# Altium schematic sheet Top.SchDoc
size A4; SheetNumber: 1; SheetTotal: 5
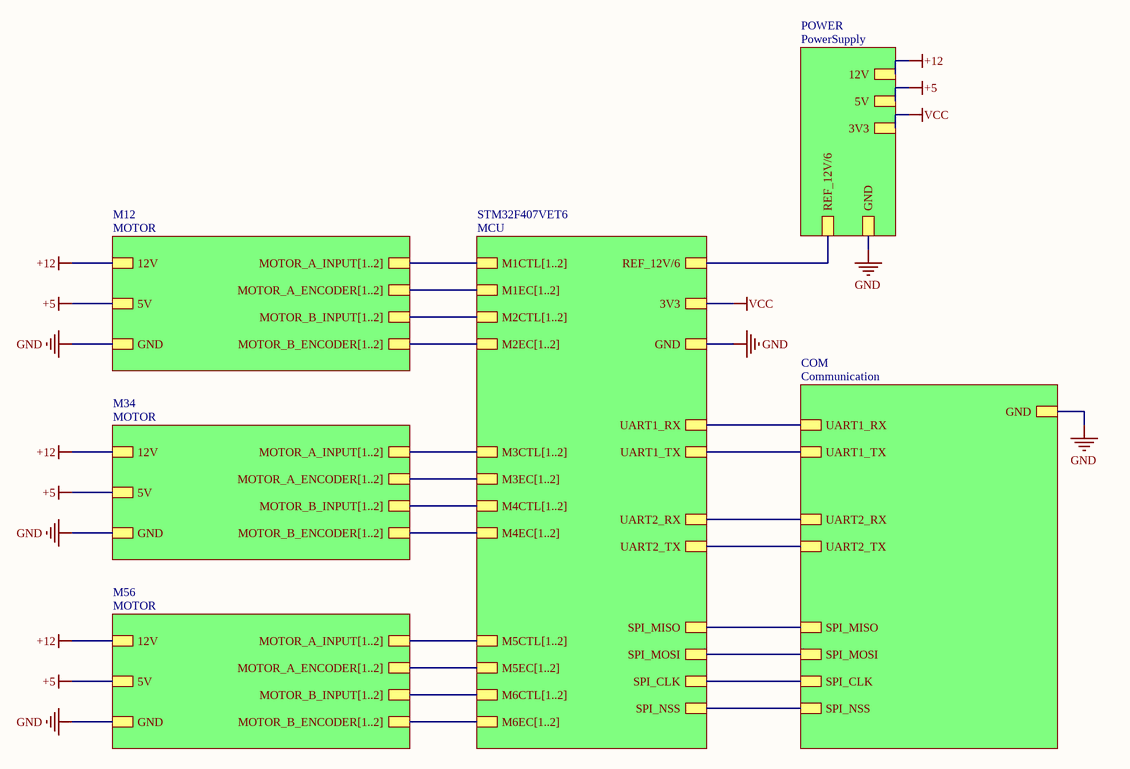
[diagram p0: Top.SchDoc]

## Sub-sheets
COM = Communication: UART1_RX, UART1_TX, UART2_RX, UART2_TX, SPI_MISO, SPI_MOSI, SPI_CLK, SPI_NSS, GND
M12 = MOTOR: 12V, GND, MOTOR_A_INPUT[1..2], MOTOR_A_ENCODER[1..2], 5V, MOTOR_B_ENCODER[1..2], MOTOR_B_INPUT[1..2]
M34 = MOTOR: 12V, GND, MOTOR_A_INPUT[1..2], MOTOR_A_ENCODER[1..2], 5V, MOTOR_B_ENCODER[1..2], MOTOR_B_INPUT[1..2]
M56 = MOTOR: 12V, GND, MOTOR_A_INPUT[1..2], MOTOR_A_ENCODER[1..2], 5V, MOTOR_B_ENCODER[1..2], MOTOR_B_INPUT[1..2]
POWER = PowerSupply: 12V, 5V, 3V3, GND, REF_12V/6
STM32F407VET6 = MCU: 3V3, GND, M1CTL[1..2], M1EC[1..2], M2CTL[1..2], M2EC[1..2], REF_12V/6, M3CTL[1..2], M3EC[1..2], M4CTL[1..2], M4EC[1..2], M5CTL[1..2], M5EC[1..2], M6CTL[1..2], M6EC[1..2], UART1_RX, UART1_TX, UART2_RX, UART2_TX, SPI_MISO, SPI_MOSI, SPI_CLK, SPI_NSS

## Nets
+5: sheet POWER/5V, sheet M12/5V, sheet M34/5V, sheet M56/5V
+12: sheet POWER/12V, sheet M12/12V, sheet M34/12V, sheet M56/12V
GND: sheet POWER/GND, sheet STM32F407VET6/GND, sheet M12/GND, sheet COM/GND, sheet M34/GND, sheet M56/GND
VCC: sheet POWER/3V3, sheet STM32F407VET6/3V3
(unnamed): sheet POWER/REF_12V/6, sheet STM32F407VET6/REF_12V/6
(unnamed): sheet STM32F407VET6/UART1_RX, sheet COM/UART1_RX
(unnamed): sheet STM32F407VET6/UART1_TX, sheet COM/UART1_TX
(unnamed): sheet STM32F407VET6/UART2_RX, sheet COM/UART2_RX
(unnamed): sheet STM32F407VET6/UART2_TX, sheet COM/UART2_TX
(unnamed): sheet STM32F407VET6/SPI_MISO, sheet COM/SPI_MISO
(unnamed): sheet STM32F407VET6/SPI_MOSI, sheet COM/SPI_MOSI
(unnamed): sheet STM32F407VET6/SPI_CLK, sheet COM/SPI_CLK
(unnamed): sheet STM32F407VET6/SPI_NSS, sheet COM/SPI_NSS

## Buses and harness runs
bus sheet M12/MOTOR_A_ENCODER[1..2] = sheet STM32F407VET6/M1EC[1..2]
bus sheet M12/MOTOR_A_INPUT[1..2] = sheet STM32F407VET6/M1CTL[1..2]
bus sheet M12/MOTOR_B_ENCODER[1..2] = sheet STM32F407VET6/M2EC[1..2]
bus sheet M12/MOTOR_B_INPUT[1..2] = sheet STM32F407VET6/M2CTL[1..2]
bus sheet M34/MOTOR_A_ENCODER[1..2] = sheet STM32F407VET6/M3EC[1..2]
bus sheet M34/MOTOR_A_INPUT[1..2] = sheet STM32F407VET6/M3CTL[1..2]
bus sheet M34/MOTOR_B_ENCODER[1..2] = sheet STM32F407VET6/M4EC[1..2]
bus sheet M34/MOTOR_B_INPUT[1..2] = sheet STM32F407VET6/M4CTL[1..2]
bus sheet M56/MOTOR_A_ENCODER[1..2] = sheet STM32F407VET6/M5EC[1..2]
bus sheet M56/MOTOR_A_INPUT[1..2] = sheet STM32F407VET6/M5CTL[1..2]
bus sheet M56/MOTOR_B_ENCODER[1..2] = sheet STM32F407VET6/M6EC[1..2]
bus sheet M56/MOTOR_B_INPUT[1..2] = sheet STM32F407VET6/M6CTL[1..2]